# EAGLE design kegboard-coaster (EAGLE 5.11)
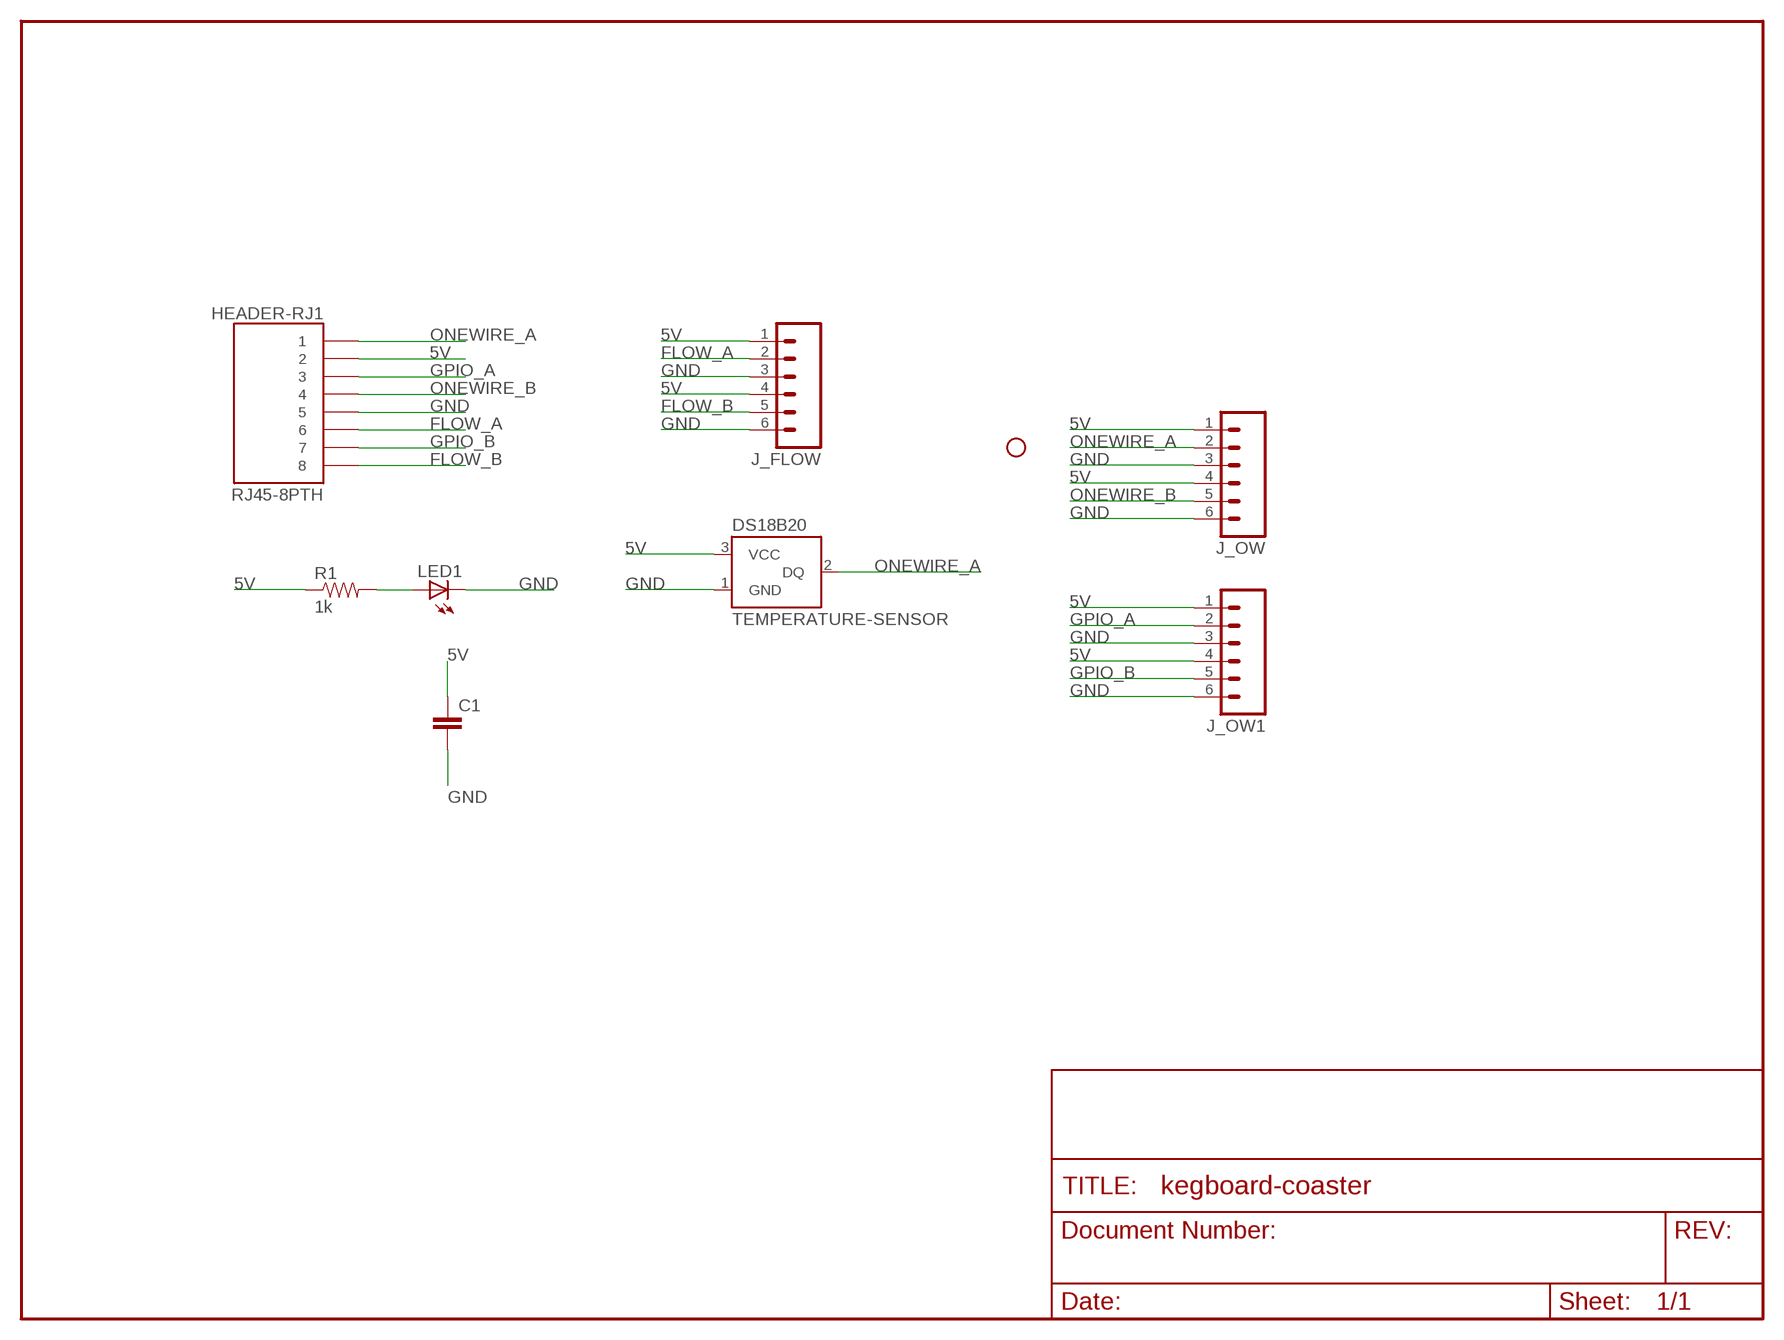
[diagram p0: schematic, sheet 1]

## Parts
C1  CAPPTH2  [CAP-PTH-SMALL2]
HEADER-RJ1  RJ45-8PTH  [RJ45-8]
J_FLOW  M06SIP  [1X06]
J_OW  M06SIP  [1X06]
J_OW1  M06SIP  [1X06]
JP2  STAND-OFF  [STAND-OFF]
LED1  LED3MM  [LED3MM]
R1  1k  RESISTORPTH1  [AXIAL-0.3]
U$1  TEMPERATURE-SENSOR  [TO-92]

## Nets
5V: C1.1 HEADER-RJ1.2 J_FLOW.1 J_FLOW.4 J_OW1.1 J_OW1.4 J_OW.1 J_OW.4 R1.P$1 U$1.3(VCC)
FLOW_A: HEADER-RJ1.6 J_FLOW.2
FLOW_B: HEADER-RJ1.8 J_FLOW.5
GND: C1.2 HEADER-RJ1.5 J_FLOW.3 J_FLOW.6 J_OW1.3 J_OW1.6 J_OW.3 J_OW.6 LED1.K(C) U$1.1(GND)
GPIO_A: HEADER-RJ1.3 J_OW1.2
GPIO_B: HEADER-RJ1.7 J_OW1.5
N$1: LED1.A R1.P$2
ONEWIRE_A: HEADER-RJ1.1 J_OW.2 U$1.2(DQ)
ONEWIRE_B: HEADER-RJ1.4 J_OW.5

## Library data of the parts
C1 = SparkFun-20100412:CAP: Capacitor Standard 0603 ceramic capacitor, and 0.1" leaded capacitor.
HEADER-RJ1 = SparkFun:RJ45-8: RJ45 Jack Simple RJ45, 8-pin connection - connector for common Cat5, Cat5e, and Cat6 Ethernet cables. Footprint not yet proven in production. Connector sku is PRT-00643; Breakout PCB sku is BOB-00716.
J_FLOW J_OW J_OW1 = SparkFun-20100412:M06: Header 6 Standard 6-pin 0.1" header. Use with straight break away headers (SKU : PRT-00116), right angle break away headers (PRT-00553), swiss pins (PRT-00743), machine pins (PRT-00117), and female headers (PRT-00115). Molex polarized connector foot print use with SKU : PRT-08094 with associated crimp pins and housings. NOTES ON THE VARIANTS LOCK and LOCK_LONGPADS... This footprint was designed to help hold the alignment of a through-hole component (i.e. 6-pin header) while soldering it into place. You may notice that each hole has been shifted either up or down by 0.005 of an inch from it's more standard position (which is a perfectly straight line). This slight alteration caused the pins (the squares in the middle) to touch the edges of the holes. Because they are alternating, it causes a "brace" to hold the component in place. 0.005 has proven to be the perfect amount of "off-center" position when using our standard breakaway headers. Although looks a little odd when you look at the bare footprint, once you have a header in there, the alteration is very hard to notice. Also, if you push a header all the way into place, it is covered up entirely on the bottom side. This idea of altering the position of holes to aid alignment will be further integrated into the Sparkfun Library for other footprints. It can help hold any component with 3 or more connection pins.
JP2 = SparkFun-20100412:STAND-OFF: Stand Off This is the mechanical footprint for a #4 phillips button head screw. Use the keepout ring to avoid running the screw head into surrounding components. SKU : PRT-00447
LED1 = SparkFun:LED: LEDs Standard schematic elements and footprints for 5mm, 3mm, 1206, and 0603 sized LEDs. 5mm - Spark Fun Electronics SKU : COM-00529 (and others)
R1 = SparkFun:RESISTOR: Resistor Basic schematic elements and footprints for 0603, 1206, and PTH 1/10th watt (small) resistors.
U$1 = geoffculp:TEMPERATURE-SENSOR

## Board
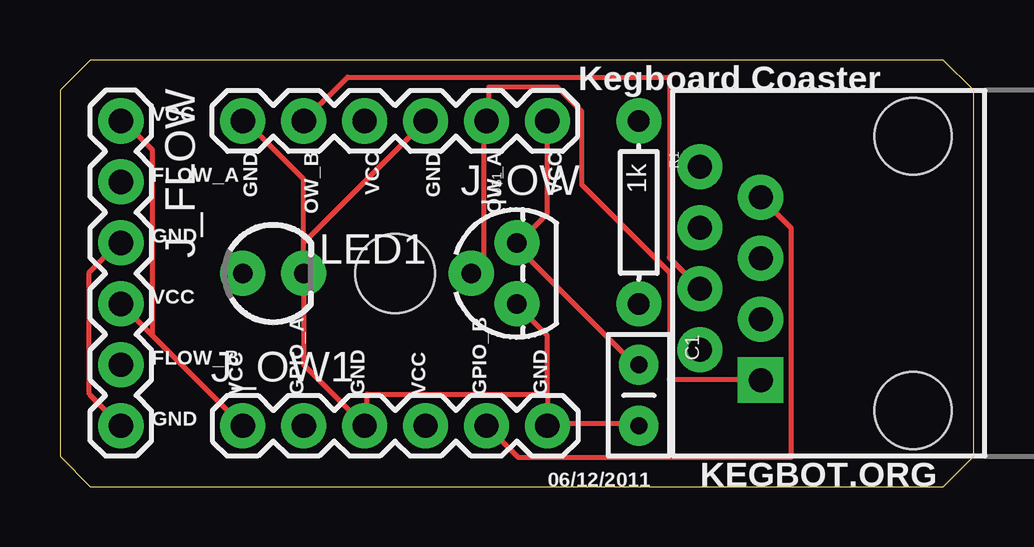
[diagram p1: board, top side]
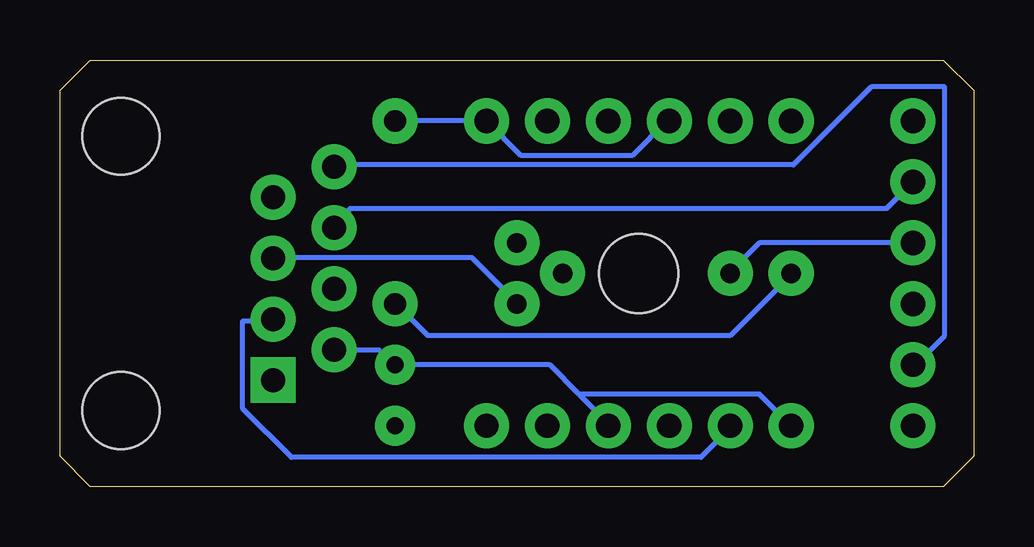
[diagram p2: board, bottom side, seen from below]

Size 38.1 x 17.78 mm. Coordinates in mm from the lower left corner, seen from the top.
Outline: 0,1.27 1.27,0 36.83,0 38.1,1.27 38.1,16.51 36.83,17.78 1.27,17.78 0,16.51 0,1.27
Copper layers (1*16): Top 0.035mm / dielectric 1.5mm / Bottom 0.035mm
Design rules "SparkFun": minimum track width 8mil, minimum drill 20mil, track to track 8mil, track to pad 8mil, pad to pad 8mil, via to via 8mil, smd to smd 8mil, copper to edge 10mil, drill to drill 8mil, minimum pad ring 12mil, minimum via ring 10mil, stop-mask expansion 4mil, vias tented up to drill 25mil, thermal gap 10mil

### Footprints (pad centres in the part's own frame; a part is rotated, then mirrored left to right if it is on the bottom)
CAP-PTH-SMALL2 = drill 0.7 pad 1.651 round: 1 0,0; 2 2.54,0
RJ45-8 = drill 1 pad 1.88 square: 1 -4.445,6.35 | drill 1 pad 1.88 round: 2 -3.175,8.89; 3 -1.905,6.35; 4 -0.635,8.89; 5 0.635,6.35; 6 1.905,8.89; 7 3.175,6.35; 8 4.445,8.89 | hole 3.2: -5.715,0; 5.715,0
1X06 = drill 1.016 pad 1.88 round: 1 0,0; 2 2.54,0; 3 5.08,0; 4 7.62,0; 5 10.16,0; 6 12.7,0
STAND-OFF = hole 3.302: 0,0
LED3MM = drill 0.813 pad 1.88 round: A -1.27,0; K 1.27,0
AXIAL-0.3 = drill 0.9 pad 1.88 round: P$1 -3.81,0; P$2 3.81,0
TO-92 = drill 0.813 pad 1.88 round: 1 -1.27,0; 2 0,1.905; 3 1.27,0

### Placement (x,y rotation side)
C1  24.13,5.08 270 top
HEADER-RJ1  35.56,8.89 90 top
J_FLOW  2.54,15.24 270 top
J_OW  20.32,15.24 180 top
J_OW1  7.62,2.54 0 top
JP2  13.97,8.89 0 top
LED1  8.89,8.89 0 top
R1  24.13,11.43 270 top
U$1  19.05,8.89 90 top

### Tracks (layer width: path | path; a pad name or v marks a point on that pad's centre or on a via)
5V
  Top 0.203: 3.86,6.3 J_FLOW.4 | 3.86,6.3 J_OW1.1 | 3.86,6.3 3.86,14.02 2.64,15.24 J_FLOW.1 | 19.1,10.16 20.32,11.38 J_OW.1 | 19.1,10.16 19.1,9.96 23.98,5.08 C1.1 | 19.1,10.16 U$1.3
  Bottom 0.203: HEADER-RJ1.2 26.62,5.69 24.79,5.69 24.18,5.08 C1.1 17.68,5.08 16.46,3.86 | 16.46,3.86 15.24,2.64 J_OW1.4 | J_OW.4 12.8,15.24 14.22,13.82 18.9,13.82 J_OW.1 R1.P$1 | 16.46,3.86 8.94,3.86 J_OW1.1
FLOW_A
  Bottom 0.203: J_FLOW.2 3.66,11.58 26.01,11.58 26.62,10.97 HEADER-RJ1.6
FLOW_B
  Bottom 0.203: J_FLOW.5 2.44,5.08 1.22,6.3 1.22,16.66 4.27,16.66 7.52,13.41 26.62,13.41 HEADER-RJ1.8
GND
  Top 0.203: 20.32,2.64 23.98,2.64 C1.2 | 20.32,3.86 20.32,2.64 | 20.32,3.86 20.32,6.3 19.1,7.52 U$1.1 | 20.32,2.64 J_OW1.6 | J_FLOW.6 1.22,3.86 1.22,8.94 2.44,10.16 J_FLOW.3 | 10.16,10.16 10.16,12.8 7.72,15.24 J_OW.6 | 10.16,10.16 LED1.K 10.16,5.08 J_OW1.3 12.8,2.64 12.8,3.86 20.32,3.86 | 10.16,10.16 J_OW.3
  Bottom 0.203: HEADER-RJ1.5 29.06,9.55 20.93,9.55 19.1,7.72 U$1.1 | J_FLOW.3 8.94,10.16 10.16,8.94 LED1.K
GPIO_A
  Bottom 0.203: J_OW1.2 10.16,2.44 11.38,1.22 28.45,1.22 30.48,3.25 30.48,6.91 29.26,6.91 HEADER-RJ1.3
GPIO_B
  Top 0.203: J_OW1.5 19.1,1.22 30.48,1.22 30.48,10.77 29.26,11.99 HEADER-RJ1.7
N$1
  Bottom 0.203: LED1.A 7.72,8.74 10.16,6.3 22.76,6.3 23.98,7.52 R1.P$2
ONEWIRE_A
  Top 0.203: U$1.2 17.27,8.94 17.68,9.35 17.68,15.24 J_OW.2 17.88,15.24 17.88,16.66 20.73,16.66 21.74,15.65 21.74,12.6 25.4,8.94 25.4,4.47 29.06,4.47 HEADER-RJ1.1
ONEWIRE_B
  Top 0.203: J_OW.5 11.99,17.07 25.4,17.07 25.4,9.55 26.62,8.33 HEADER-RJ1.4

### Text on the board
tPlace: Kegboard Coaster | VCC | GND | OW_B | VCC | GND | OW_A | VCC | FLOW_A | GND | VCC | FLOW_B | VCC | GPIO_A | GND | VCC | GPIO_B | GND | GND | 06/12/2011 | KEGBOT.ORG